# Altium schematic sheet Audio.SchDoc
size A3; SheetNumber: 6; SheetTotal: 7
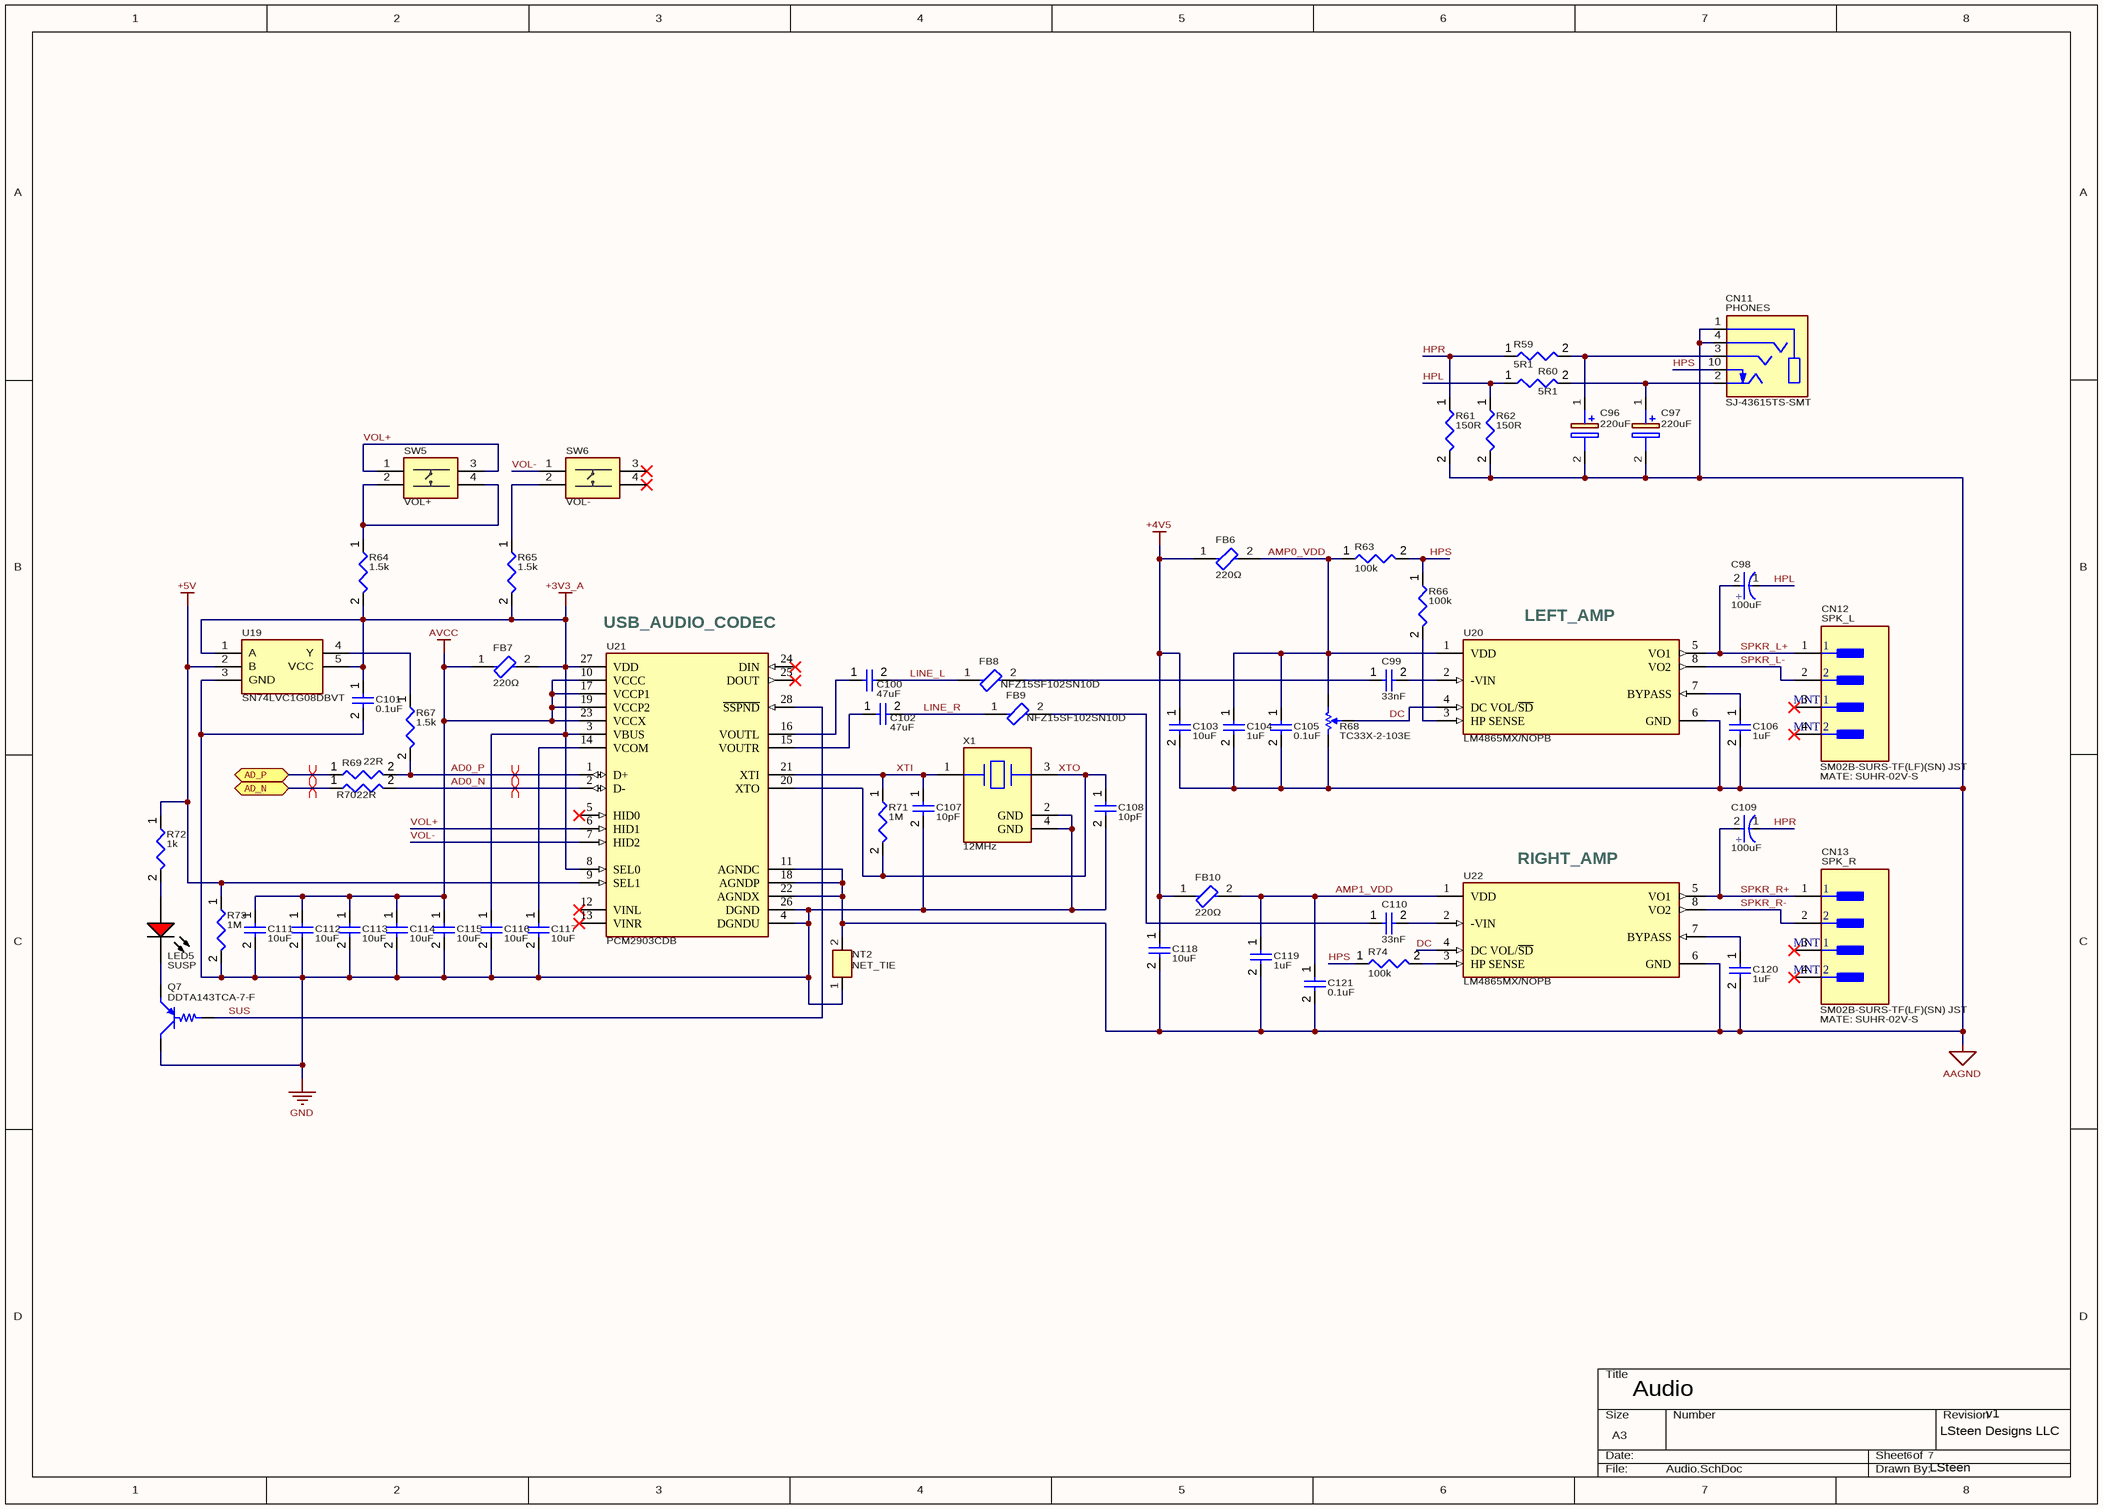
[diagram p0: Audio.SchDoc]

## Parts
C96  220uF  [CAPPM6032X280N]
C97  220uF  [CAPPM6032X280N]
C98  100uF  [FP-CX-MFG]
C99  33nF  [CAPC0603(1608)100_L]
C100  47uF  [CAPC0603(1608)100_L]
C101  0.1uF  [CAPC1005X56X25LL10T15]
C102  47uF  [CAPC0603(1608)100_L]
C103  10uF  [CAPC0805(2012)145_L]
C104  1uF  [CAPC0603(1608)100_L]
C105  0.1uF  [CAPC1005X56X25LL10T15]
C106  1uF  [CAPC0603(1608)100_L]
C107  10pF  [CAPC1005X56X25LL10T15]
C108  10pF  [CAPC1005X56X25LL10T15]
C109  100uF  [FP-CX-MFG]
C110  33nF  [CAPC0603(1608)100_L]
C111  10uF  [CAPC0805(2012)145_L]
C112  10uF  [CAPC1005X56X25LL10T15]
C113  10uF  [CAPC1005X56X25LL10T15]
C114  10uF  [CAPC1005X56X25LL10T15]
C115  10uF  [CAPC1005X56X25LL10T15]
C116  10uF  [CAPC0603(1608)100_L]
C117  10uF  [CAPC1005X56X25LL10T15]
C118  10uF  [CAPC0805(2012)145_L]
C119  1uF  [CAPC0603(1608)100_L]
C120  1uF  [CAPC0603(1608)100_L]
C121  0.1uF  [CAPC1005X56X25LL10T15]
CN11  PHONES  [CUI_SJ-43615TS-SMT]
CN12  SPK_L  [FP-SM02B-SURS-TF_LF_SN-MFG]
CN13  SPK_R  [FP-SM02B-SURS-TF_LF_SN-MFG]
FB6  220Ω  [FP-BLM18-0_15-t0_5-IPC_B]
FB7  220Ω  [FP-BLM18-0_15-t0_5-IPC_B]
FB8  NFZ15SF102SN10D  [FP-NFZ15S-IPC_A]
FB9  NFZ15SF102SN10D  [FP-NFZ15S-IPC_A]
FB10  220Ω  [FP-BLM18-0_15-t0_5-IPC_B]
LED5  SUSP  [EVRL-0603-2_V]
NT2  NET_TIE  [NET_TIE1]  (net tie, no BOM)
Q7  DDTA143TCA-7-F  [SOT96P240X120-3N]
R59  5R1  [RESC2013X50X35ML15T15]
R60  5R1  [RESC2013X50X35ML15T15]
R61  150R  [RESC0402(1005)_L]
R62  150R  [RESC0402(1005)_L]
R63  100k  [RESC0402(1005)_L]
R64  1.5k  [RESC0402(1005)_L]
R65  1.5k  [RESC0402(1005)_L]
R66  100k  [RESC0402(1005)_L]
R67  1.5k  [RESC0402(1005)_L]
R68  TC33X-2-103E  [BOUR-TC33X-2_V]
R69  22R  [RESC0402(1005)_L]
R70  22R  [RESC0402(1005)_L]
R71  1M  [RESC0402(1005)_L]
R72  1k  [RESC0402(1005)_L]
R73  1M  [RESC0402(1005)_L]
R74  100k  [RESC0402(1005)_L]
SW5  VOL+  [APTCLGTVTR]
SW6  VOL-  [APTCLGTVTR]
U19  SN74LVC1G08DBVT  [SOT95P280X145-5N]
U20  LM4865MX/NOPB  [FP-D0008A-IPC_C]
U21  PCM2903CDB  [FP-DB0028A-IPC_A]
U22  LM4865MX/NOPB  [FP-D0008A-IPC_C]
X1  12MHz  [FP-ABM8G-MFG]

## Ports
AD_N (bidir, see USB[1B]), AD_P (bidir, see USB[1B])

## Nets
+3V3_A: C101.1 C116.1 FB7.2 R64.2 R65.2 U19.1(A) U19.5(VCC) U21.3(VBUS) U21.8(SEL0) U21.27(VDD)
+4V5: C103.1 C118.1 FB6.1 FB10.1
+5V: R72.1 R73.1 U19.2(B) U21.9(SEL1)
AAGND: C96.2(-) C97.2(-) C103.2 C104.2 C105.2 C106.2 C118.2 C119.2 C120.2 C121.2 CN11.1(SLEEVE) CN11.4(RING2) NT2.2 R61.2 R62.2 R68.3 U20.6(GND) U21.11(AGNDC) U21.18(AGNDP) U21.22(AGNDX) U22.6(GND)
AVCC: C111.1 C112.1 C113.1 C114.1 C115.1 FB7.1 U21.10(VCCC) U21.17(VCCP1) U21.19(VCCP2) U21.23(VCCX)
GND: C101.2 C107.2 C108.2 C111.2 C112.2 C113.2 C114.2 C115.2 C116.2 C117.2 NT2.1 Q7.3(C) R73.2 U19.3(GND) U21.4(DGNDU) U21.26(DGND) X1.2(GND) X1.4(GND)
AD0_N: R70.2 U21.2(D-)
AD0_P: R67.2 R69.2 U21.1(D+)
AD_N: R70.1 ; port AD_N
AD_P: R69.1 ; port AD_P
AMP0_VDD: C104.1 C105.1 FB6.2 R63.1 R68.1 U20.1(VDD)
AMP1_VDD: C119.1 C121.1 FB10.2 U22.1(VDD)
DC: R68.2 U20.4(DC_VOL/~{SD}) U22.4(DC_VOL/~{SD})
HPL: C98.1(C) R60.1 R62.1
HPR: C109.1(C) R59.1 R61.1
HPS: CN11.10(TIP_SWITCH) R63.2 R66.1 R74.1
LINE_L: C100.2 FB8.1
LINE_R: C102.2 FB9.1
SPKR_L+: C98.2(A) CN12.1 U20.5(VO1)
SPKR_L-: CN12.2 U20.8(VO2)
SPKR_R+: C109.2(A) CN13.1 U22.5(VO1)
SPKR_R-: CN13.2 U22.8(VO2)
SUS: Q7.1(B) U21.28(~{SSPND})
VOL+: SW5.1 SW5.3 U21.6(HID1)
VOL-: SW6.1 U21.7(HID2)
XTI: C107.1 R71.1 U21.21(XTI) X1.1
XTO: C108.1 R71.2 U21.20(XTO) X1.3
NetC96_1: C96.1(+) CN11.3(RING1) R59.2
NetC97_1: C97.1(+) CN11.2(TIP) R60.2
NetC99_1: C99.1 FB8.2
NetC99_2: C99.2 U20.2(-VIN)
NetC100_1: C100.1 U21.16(VOUTL)
NetC102_1: C102.1 U21.15(VOUTR)
NetC106_1: C106.1 U20.7(BYPASS)
NetC110_1: C110.1 FB9.2
NetC110_2: C110.2 U22.2(-VIN)
NetC117_1: C117.1 U21.14(VCOM)
NetC120_1: C120.1 U22.7(BYPASS)
NetLED5_1: LED5.1(A) R72.2
NetLED5_2: LED5.2(K) Q7.2(E)
NetR64_1: R64.1 SW5.2 SW5.4
NetR65_1: R65.1 SW6.2
NetR66_2: R66.2 U20.3(HP_SENSE)
NetR67_1: R67.1 U19.4(Y)
NetR74_2: R74.2 U22.3(HP_SENSE)

Not connected (* = marked no-connect by the designer): CN12 3(MNT_1)* 4(MNT_2)*; CN13 3(MNT_1)* 4(MNT_2)*; SW6 3* 4*; U21 5(HID0)* 12(VINL)* 13(VINR)* 24(DIN)* 25(DOUT)*

## Layout directives
differential pair: AD_N, AD_P
differential pair; differential pair class USB 2.0: AD0_N, AD0_P

## Notes on the sheet
- (near CN11) SJ-43615TS-SMT
- (near U21) USB_AUDIO_CODEC
- (near U20) LEFT_AMP
- (near CN12) MATE: SUHR-02V-S
- (near CN12) SM02B-SURS-TF(LF)(SN) JST
- (near U22) RIGHT_AMP
- (near CN13) MATE: SUHR-02V-S
- (near CN13) SM02B-SURS-TF(LF)(SN) JST
- Audio
- 6
- 7
- LSteen Designs LLC
- v1
- LSteen
- (in symbol CMP-05427-000056-1) +

## Library data of the parts
C96 C97 = TR3C227K6R3C0225: Capacitor Polarised; Manufacturer_Name: Vishay; Datasheet Link: http://www.vishay.com/doc?40080; Height: 2.8mm; Manufacturer_Part_Number: TR3C227K6R3C0225; Supplier 1: Mouser; Supplier Part Number 1: 74-TR3C227K6R3C0225
C98 C109 = CMP-05427-000056-1: CAP ALUM POLY 100UF 20% 6.3V SMD; Leakage Current: 63uA; Polarity: Polar; Lead Diameter: 2.4mm; Dissipation Factor: 0.06%; Ripple Current: 2.7A; ESR (Equivalent Series Resistance): 15mR; Life (Hours): 1000Hour; Voltage Rating: 6.3V; Case/Package: 2917; Lead Pitch: 1.3mm; Series: SP-Cap CX; Weight: 0.004586oz; Radiation Hardening: No; Case Code (Imperial): 2917; Length: 7.3mm; Number of Pins: 2; Lead Free: Lead Free; REACH SVHC: No SVHC; Max Operating Temperature: 105°C; Package Quantity: 3500; Packaging: Tape and Reel; Height - Seated (Max): 0.075inch; Mount: Surface Mount; Height: 1.9mm; Termination: SMD/SMT; Voltage: 6.3V; Construction: Flat; Width: 0.169inch; Ripple Current (AC): 2.7A; Capacitance: 100uF; Voltage Rating (DC): 6.3V; Case Code (Metric): 7343; Min Operating Temperature: -40°C; Tolerance: 20%; RoHS Compliant: Yes; Depth: 4.3mm
C99 C110 = CMP-001-00076-4: Chip Capacitor, 33nF +/-20%, 10V, 0603, Thickness 1 mm; Tolerance: 10%; Mounting Technology: SMT; Case/Package: 0603; Pins: 2; Min Operating Temperature: -55°C; Max Operating Temperature: 85°C; Value: 33nF; Voltage Rating: 10V
C100 C102 = CMP-001-00076-4: Chip Capacitor, 47uF +/-20%, 10V, 0603, Thickness 1 mm; Tolerance: 10%; Mounting Technology: SMT; Case/Package: 0603; Pins: 2; Min Operating Temperature: -55°C; Max Operating Temperature: 85°C; Value: 47uF; Voltage Rating: 10V
C101 C105 C121 = CMP-001-00001-6: Chip Capacitor, 0.1 uF, +/- 5%, 16 V, 0402 (1005 Metric); Capacitor Type: Ceramic; Voltage Rating: 16V; Max Operating Temperature: 125°C; Min Operating Temperature: -55°C; Case/Package: 0402; Value: 0.1uF; Mounting Technology: SM; Pins: 2; Tolerance: 5%; RoHS Compliant: True
C103 C111 C118 = CMP-001-00079-4: Chip Capacitor, 10µF +/-20%, 25V, 0805, Thickness 1.45 mm; Tolerance: 10%; Max Operating Temperature: 85°C; Value: 10µF; Case/Package: 0805; Voltage Rating: 25V; Min Operating Temperature: -55°C; Mounting Technology: SMT; Pins: 2
C104 C106 C119 C120 = CMP-001-00076-4: Chip Capacitor, 1uF +/-20%, 10V, 0603, Thickness 1 mm; Tolerance: 10%; Mounting Technology: SMT; Case/Package: 0603; Pins: 2; Min Operating Temperature: -55°C; Max Operating Temperature: 85°C; Value: 1uF; Voltage Rating: 10V
C107 C108 = CMP-001-00001-6: Chip Capacitor, 10 pF, +/- 5%, 16 V, 0402 (1005 Metric); Capacitor Type: Ceramic; Voltage Rating: 16V; Max Operating Temperature: 125°C; Min Operating Temperature: -55°C; Case/Package: 0402; Value: 10pF; Mounting Technology: SM; Pins: 2; Tolerance: 5%; RoHS Compliant: True
C112-C115 C117 = CMP-001-00001-6: Chip Capacitor, 10 uF, +/- 5%, 16 V, 0402 (1005 Metric); Capacitor Type: Ceramic; Voltage Rating: 16V; Max Operating Temperature: 125°C; Min Operating Temperature: -55°C; Case/Package: 0402; Value: 10uF; Mounting Technology: SM; Pins: 2; Tolerance: 5%; RoHS Compliant: True
C116 = CMP-001-00076-4: Chip Capacitor, 10uF +/-20%, 10V, 0603, Thickness 1 mm; Tolerance: 10%; Mounting Technology: SMT; Case/Package: 0603; Pins: 2; Min Operating Temperature: -55°C; Max Operating Temperature: 85°C; Value: 10uF; Voltage Rating: 10V
CN11 = SJ-43615TS-SMT: 4 Conductor 3.5 mm Mid Mount SMT Audio Jack w/ Tip Switch; MP: SJ-43615TS-SMT; Value: *; Package: None; Price: None; Availability: Unavailable; Supplier 1: Mouser; Supplier Part Number 1: 490-SJ43615TSSMTTR
CN12 = CMP-17439-000279-1: LCSC_CONN HEADER SMD R/A 2POS 0.8MM; Manufacturer Part Number: SM02B-SURS-TF(LF)(SN); Number of Contacts: 2; Working Voltage: 30V; Wire/Cable Gauge: 32AWG; Gender: Male; Body Plating: Tin; Current Rating: 500mA; Lead Pitch: 0.8mm; Color: Natural; Min Operating Temperature: -25°C; Insulation Material: Nylon; Number of Rows: 1; Flammability Rating: UL94 V-0; Number of Positions: 2; Contact Shape: Rectangular; Orientation: Horizontal; Contact Material: Copper Alloy; Fastening Type: Pull; Max Operating Temperature: 85°C; Termination: Solder; Contact Type: Outer Shroud Contact; Series: SUR; Insulation Color: Natural; Packaging: Cut Tape; Contact Finish - Mating: TIN; REACH SVHC: No SVHC; Pitch: 0.8mm; Contact Plating: Tin; Lead Free: Lead Free; Voltage Rating: 30V; Mount: Surface Mount; Connector Type: Header; Number of Poles: 2; Material: Polyamide
CN13 = CMP-17439-000279-1: LCSC_CONN HEADER SMD R/A 2POS 0.8MM; Number of Contacts: 2; Working Voltage: 30V; Wire/Cable Gauge: 32AWG; Gender: Male; Body Plating: Tin; Current Rating: 500mA; Lead Pitch: 0.8mm; Color: Natural; Min Operating Temperature: -25°C; Insulation Material: Nylon; Number of Rows: 1; Flammability Rating: UL94 V-0; Number of Positions: 2; Contact Shape: Rectangular; Orientation: Horizontal; Contact Material: Copper Alloy; Fastening Type: Pull; Max Operating Temperature: 85°C; Termination: Solder; Contact Type: Outer Shroud Contact; Series: SUR; Insulation Color: Natural; Packaging: Cut Tape; Contact Finish - Mating: TIN; REACH SVHC: No SVHC; Pitch: 0.8mm; Contact Plating: Tin; Lead Free: Lead Free; Voltage Rating: 30V; Mount: Surface Mount; Connector Type: Header; Number of Poles: 2; Material: Polyamide
FB6 FB7 FB10 = CMP-06046-002311-1: Chip Ferrite Bead, 0603, 220Ω @ 100MHz, 25%, 0.04Ω, 2.5A; RoHS Compliant: Yes
FB8 FB9 = CMP-06046-002280-1: Ferrite Bead 1000Ω @ 100MHz ±25% 230mA 1.4Ω 0402 Paper T/R
LED5 = CMP-2100-03578-1: Chip LED, Red, 5 V, 25 mA, -40 to 85 degC, 2-Pin SMD (0603), RoHS, Tape and Reel; Manufacturer: Everlight Electronics; Manufacturer Part Number: 19-217/R6C-AL1M2VY/3T; Forward Voltage: 2.2V; Lens Style: Clear; Shape: Rectangular; Forward Current: 25mA; Luminous Intensity-Nom: 20mcd; Channels: 1; Optoelectronic Device Type: SINGLE COLOR LED; Viewing Angle: 120°; Overall Height: 0.4mm; Package Reference: 0603; Case/Package: 0603; RoHSCompliant: false; Package Description: 2-Pin Surface Mount Device, Body 1.6 x 0.8 mm; Colour: Red; Lead Free: LeadFree; Datasheet URL: https://datasheet.ciiva.com/4688/el-19-217-r6c-al1m2vy-3tpdf-187026-4688713.pdf; Manufacturer URL: http://www.everlight.com/; Datasheet Version: Rev. 1, 01/2005; Supplier: Digikey; Supplier Part Number: 1080-1585-6-ND; RoHS: Yes; Category: LEDs; Mounting Technology: Surface Mount; Pins: 2; Color: Red; Min Operating Temperature: -40°C; Max Operating Temperature: 85°C; Packaging: Tape and Reel; Size: 1mm; Terminal Pitch: 1.5mm; Reach SVHC Compliant: Yes; RoHS Compliant: Yes; ComponentLink1URL: https://datasheet.ciiva.com:443/pdfs/VipMasterIC/IC/EVER/EVER-S-A0007433843/EVER-S-A0007433843-1.pdf?src-supplier=IHS+Markit; ComponentLink1Description: https://datasheet.ciiva.com:443/pdfs/VipMasterIC/IC/EVER/EVER-S-A0007433843/EVER-S-A0007433843-1.pdf?src-supplier=IHS+Markit; ComponentLink2URL: https://media.digikey.com/pdf/Data%20Sheets/Everlight%20PDFs/19-217-R6C-AL1M2VY-3T.pdf?src-supplier=Digikey; ComponentLink2Description: https://media.digikey.com/pdf/Data%20Sheets/Everlight%20PDFs/19-217-R6C-AL1M2VY-3T.pdf?src-supplier=Digikey
Q7 = DDTA143TCA-7-F: PNP TRANSISTOR; Supplier 1: Mouser; Supplier Part Number 1: 621-DDTA143TCA-F
R59 R60 = CMP-009-00018-5: Chip Resistor, 5.1 Ohm, +/- 1%, 125 mW, -55 to 155 degC, 0805 (2012 Metric); Power: 125mW; Voltage Rating: 150V; Tolerance: 1%; Pins: 2; Min Operating Temperature: -55°C; Case/Package: 0805; Max Operating Temperature: 155°C; RoHS Compliant: True; Value: 5R1; Mounting Technology: SM
R61 R62 = CMP-009-00138-3: Chip Resistor, 150 Ohms, +/-5 %, 63 mW, -55 to 155 degC, 0402; Tolerance: 5%; Power: 63mW; Max Operating Temperature: 155°C; Pins: 2; Value: 150R; Min Operating Temperature: -55°C; Case/Package: 0402
R63 R66 R74 = CMP-009-00138-3: Chip Resistor, 100 kOhms, +/-5 %, 63 mW, -55 to 155 degC, 0402; Tolerance: 5%; Power: 63mW; Max Operating Temperature: 155°C; Pins: 2; Value: 100k; Min Operating Temperature: -55°C; Case/Package: 0402
R64 R65 R67 = CMP-009-00138-3: Chip Resistor, 1.5 kOhms, +/-5 %, 63 mW, -55 to 155 degC, 0402; Tolerance: 5%; Power: 63mW; Max Operating Temperature: 155°C; Pins: 2; Value: 1.5k; Min Operating Temperature: -55°C; Case/Package: 0402
R68 = CMP-2100-03695-1: Trimming Potentiometer, 10000 Ohm, -40 to 100 degC, 3-Pin SMD, RoHS, Tape and Reel; Manufacturer: Bourns; Tolerance: 25%; Max Power Dissipation: 100mW; Number of Turns: 1; Resistance: 10KOhm; Temperature Coefficient: 250ppm/degreesC; Voltage Rating (DC): 50V; Datasheet URL: http://www.bourns.com/docs/Product-Datasheets/TC33.pdf; Composition: Potentiometer; Package Description: 3-Pin Surface Mount Device, Body 3.8 x 3.6 mm; Weight: 29.4mg; Power Rating: 100mW; Termination: FootPrint; Manufacturer URL: http://www.bourns.com/; Width: 0.118inch; Height: 0.047inch; Military Standard: Not; Radiation Hardening: No; Colour: Silver; Case/Package: SMD/SMT; Depth: 3.8mm; Min Operating Temperature: -40degC; Lead Free: LeadFree; Datasheet Version: 42583.0; REACH SVHC: NoSVHC; Length: 3mm; RoHSCompliant: true; Contact Plating: Silver; Taper: Linear; Packaging: TapeandReel; Mount: SurfaceMount; Max Operating Temperature: 100degC; Package Reference: TC33X-2; Package Quantity: 2500
R69 R70 = CMP-009-00138-3: Chip Resistor, 22 Ohms, +/-5 %, 63 mW, -55 to 155 degC, 0402; Tolerance: 5%; Power: 63mW; Max Operating Temperature: 155°C; Pins: 2; Value: 22R; Min Operating Temperature: -55°C; Case/Package: 0402
R71 R73 = CMP-009-00138-3: Chip Resistor, 1 MOhms, +/-5 %, 63 mW, -55 to 155 degC, 0402; Tolerance: 5%; Power: 63mW; Max Operating Temperature: 155°C; Pins: 2; Value: 1M; Min Operating Temperature: -55°C; Case/Package: 0402
R72 = CMP-009-00138-3: Chip Resistor, 1 kOhms, +/-5 %, 63 mW, -55 to 155 degC, 0402; Tolerance: 5%; Power: 63mW; Max Operating Temperature: 155°C; Pins: 2; Value: 1k; Min Operating Temperature: -55°C; Case/Package: 0402
SW5 SW6 = APTCLGTVTR: Switch; Manufacturer_Name: Apem; Datasheet Link: https://media.digikey.com/pdf/Data%20Sheets/APEM%20Components%20PDFs/APTCLGTV.pdf; Height: 1.87mm; Manufacturer_Part_Number: APTCLGTVTR; Mouser Part Number: 642-APTCLGTVTR; Mouser Price/Stock: https://www.mouser.co.uk/ProductDetail/Apem/APTCLGTVTR?qs=ikKlZSMjbcRNf%252Bwzp31ctg%3D%3D; Supplier 1: Mouser; Supplier Part Number 1: 642-APTCLGTVTR
U19 = SN74LVC1G08DBVT: Integrated Circuit; Manufacturer_Name: Texas Instruments; Datasheet Link: http://www.ti.com/lit/gpn/sn74lvc1g08; Height: 1.45mm; Manufacturer_Part_Number: SN74LVC1G08DBVT; Mouser Part Number: 595-SN74LVC1G08DBVT; Mouser Price/Stock: https://www.mouser.co.uk/ProductDetail/Texas-Instruments/SN74LVC1G08DBVT?qs=nqigI8dpoHJVJyaZlPLFSg%3D%3D; Arrow Part Number: SN74LVC1G08DBVT; Arrow Price/Stock: https://www.arrow.com/en/products/sn74lvc1g08dbvt/texas-instruments?region=nac
U20 U22 = CMP-04894-000019-1: IC AMP CLASS AB MONO 1W 8SOIC; Quiescent Current: 3.5mA; Min Supply Voltage: 2.7V; Max Supply Voltage: 5.5V; Power Supply Rejection Ratio (PSRR): 50dB; Supply Type: Single; Operating Supply Voltage: 5V; Supply Current: 4mA; Number of Channels: 1; Gain: 20dB; Contact Plating: Tin; Series: Boomer®; Min Operating Temperature: -40°C; Max Output Power: 1W; Packaging: Tape and Reel; RoHS Compliant: Yes; Case/Package: SOIC N; Lead Free: Lead Free; Max Operating Temperature: 85°C; Radiation Hardening: No; Mount: Surface Mount; Number of Pins: 8; Output Power: 1W; Package Quantity: 1; Nominal Supply Current: 4mA
U21 = CMP-04873-000010-1: IC STERO AUD CODEC W/USB 28SSOP; Supply Current: 70mA; Max Supply Voltage: 3.6V; Number of DAC Channels: 2; Min Supply Voltage: 3V; Operating Supply Voltage: 3.3V; Resolution: 16b; Interface: USB; Sampling Rate: 48KS/s; Signal to Noise Ratio (SNR): 89dB; Nominal Supply Current: 70mA; Series: -; Radiation Hardening: No; Number of ADC Channels: 2; Package Quantity: 50; RoHS Compliant: Yes; Number of D/A Converters: 2; Number of A/D Converters: 2; Packaging: Rail/Tube; Number of Analog Outputs: 2; Mount: Surface Mount; Max Operating Temperature: 85°C; REACH SVHC: No SVHC; Min Operating Temperature: -25°C; Lead Free: Lead Free; Number of Analog Inputs: 2; Number of Pins: 28; Case/Package: SSOP
X1 = CMP-27762-015546-1: Crystal 12MHz ±30ppm (Tol) ±30ppm (Stability) 10pF FUND 120Ω 4-Pin SMD T/R; ESR (Equivalent Series Resistance): 120R; Height: 1mm; Operating Frequency: 12 MHz; Case/Package: CSMD; Max Operating Temperature: 70°C; Load Capacitance: 10pF; Series: ABM8G; Depth: 2.5mm; Package Quantity: 1000; Frequency: 12MHz; Min Operating Temperature: -20°C; Length: 3.2mm; Termination: SMD/SMT; Frequency Tolerance: 30ppm; Frequency Stability: 30ppm; Tolerance: 30ppm; Lead Free: Lead Free; Number of Pins: 4; Mount: Surface Mount; Width: 2.5mm; Packaging: Tape and Reel